# EAGLE design sensormoisture (EAGLE 7.2.0)
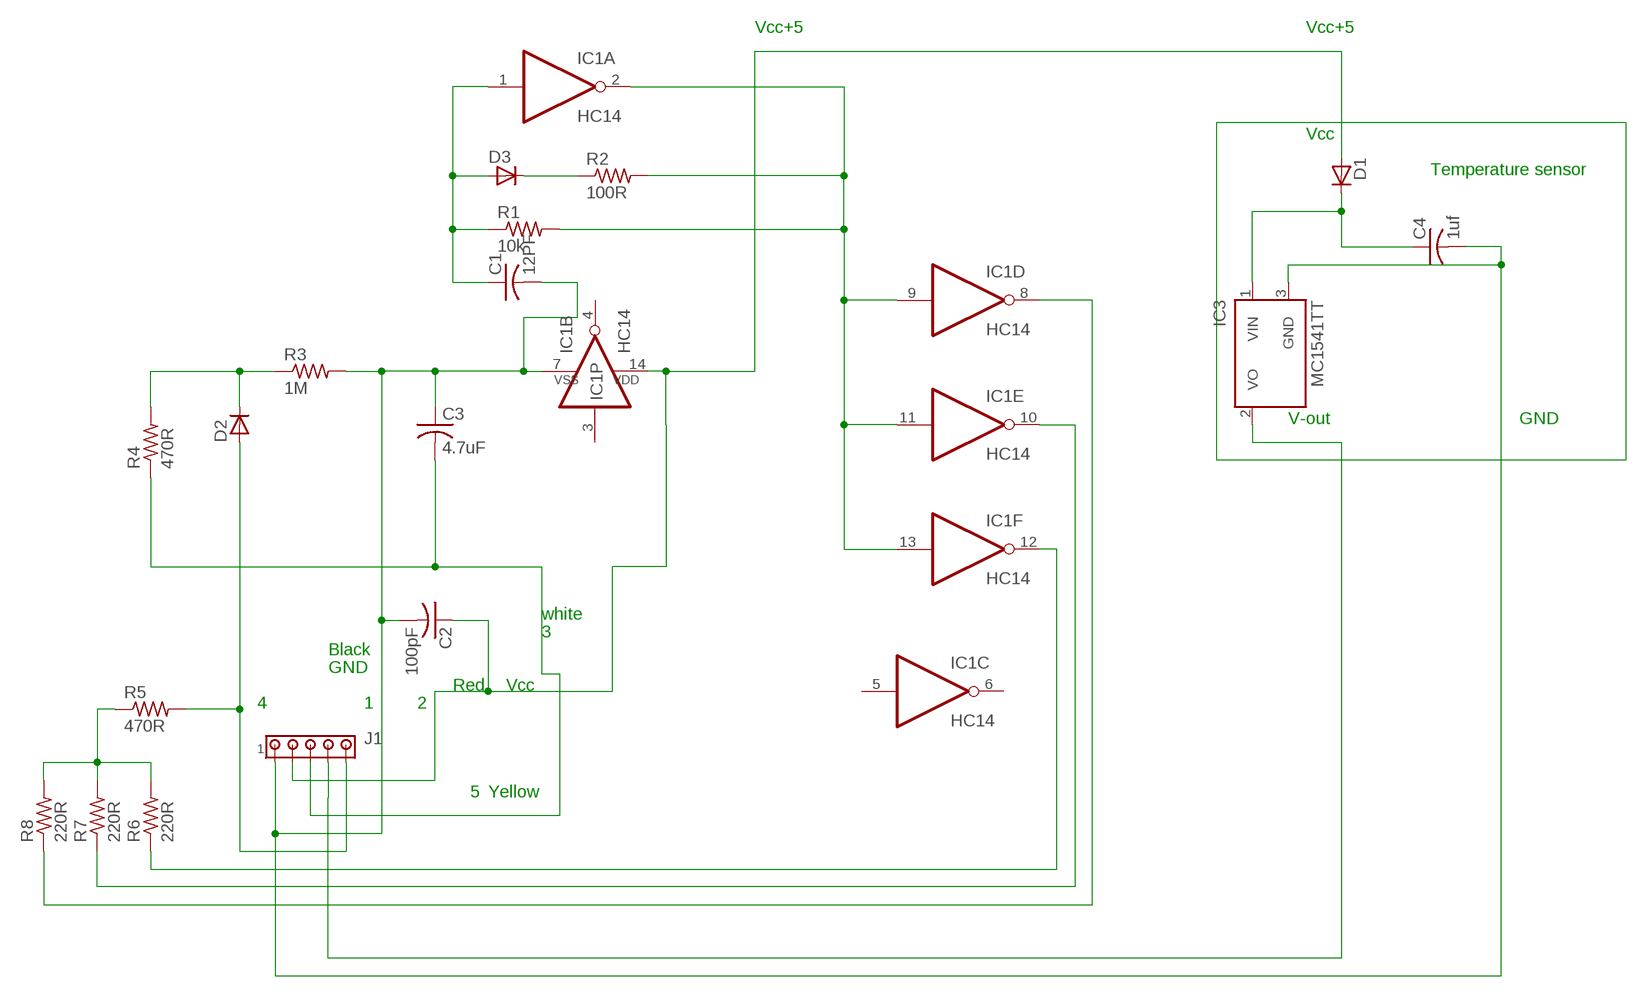
[diagram p0: schematic, sheet 1]

## Parts
C1  12PF  C-USC0805  [C0805]
C2  100pF  C-USC1206K  [C1206K]
C3  4.7uF  C-USC1206  [C1206]
C4  1uf  C-USC1206K  [C1206K]
D1  D-MLL-34  [MELF-MLL34]
D2  D-MLL-34  [MELF-MLL34]
D3  D-MLL-34  [MELF-MLL34]
IC1  HC14  4584D  [SO14]
IC3  MC1541TT  [SOT23]
J1  MTA05-100  [10X05MTA]
R1  10k  R-US_M0805  [M0805]
R2  100R  R-US_M0805  [M0805]
R3  1M  R-US_M0805  [M0805]
R4  470R  R-US_M0805  [M0805]
R5  470R  R-US_M0805  [M0805]
R6  220R  R-US_M0805  [M0805]
R7  220R  R-US_M0805  [M0805]
R8  220R  R-US_M0805  [M0805]

## Nets
N$1: C1.1 D3.2(A) IC1.1(A:I) R1.1
N$2: D3.1(C) R2.1
N$3: IC1.2(A:O) IC1.9(D:I) IC1.11(E:I) IC1.13(F:I) R1.2 R2.2
N$5: R5.1 R6.2 R7.2 R8.2
N$6: C2.1 D1.2(A) IC1.14(P:VDD) J1.2
N$7: C4.1 D1.1(C) IC3.1(VIN)
N$8: D2.1(C) R3.1 R4.2
N$9: D2.2(A) J1.5 R5.2
N$10: C3.2 J1.3 R4.1
N$12: IC1.12(F:O) R6.1
N$13: IC1.10(E:O) R7.1
N$14: IC1.8(D:O) R8.1
N$15: C1.2 C2.2 C3.1 C4.2 IC1.7(P:VSS) IC3.3(GND) J1.1 R3.2
N$19: IC3.2(VO) J1.4
Unconnected: IC1.3(B:I) IC1.4(B:O) IC1.5(C:I) IC1.6(C:O)

## Notes on the sheet
- Vcc+5 | Vcc+5
- Vcc
- Temperature sensor
- V-out | GND
- white
- 3
- Black
- GND
- Red | Vcc
- 4 | 1 | 2
- 5 | Yellow

## Library data of the parts
C1-C4 = resistor:C-US: CAPACITOR, American symbol
D1-D3 = semicon-smd-ipc:D-: DIODE unfilled
IC1 = 45xx:4584: Hex SCHMITT TRIGGER (74C14)
IC3 = microchip:MC15*: 2.5V and 4.096V Voltage References Source: http://www.microchip.com .. 21653b.pdf; OC_FARNELL: unknown; OC_NEWARK: unknown
J1 = con-amp:MTA05-100: AMP connector
R1-R8 = resistor:R-US_: RESISTOR, American symbol

## Board
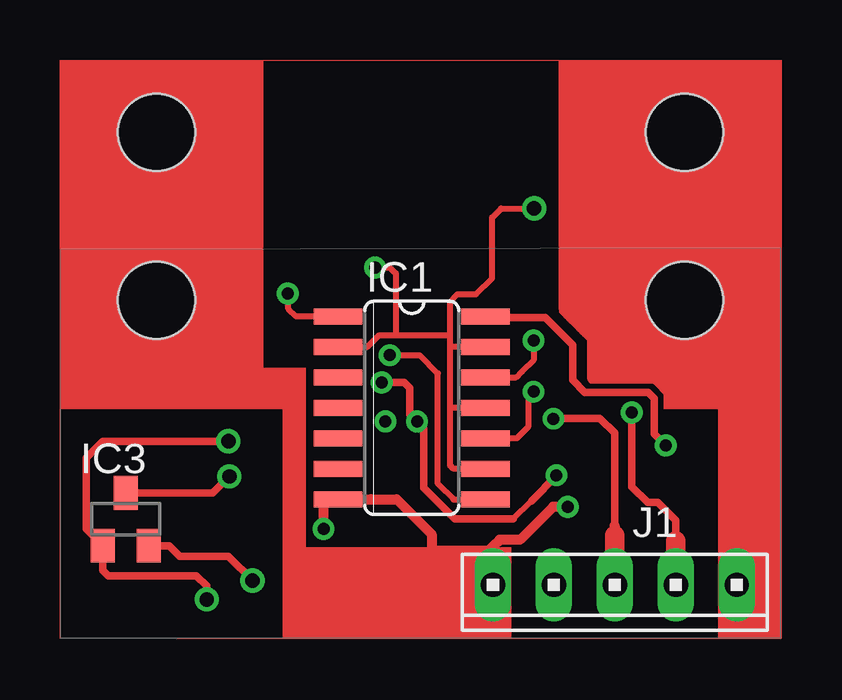
[diagram p1: board, top side]
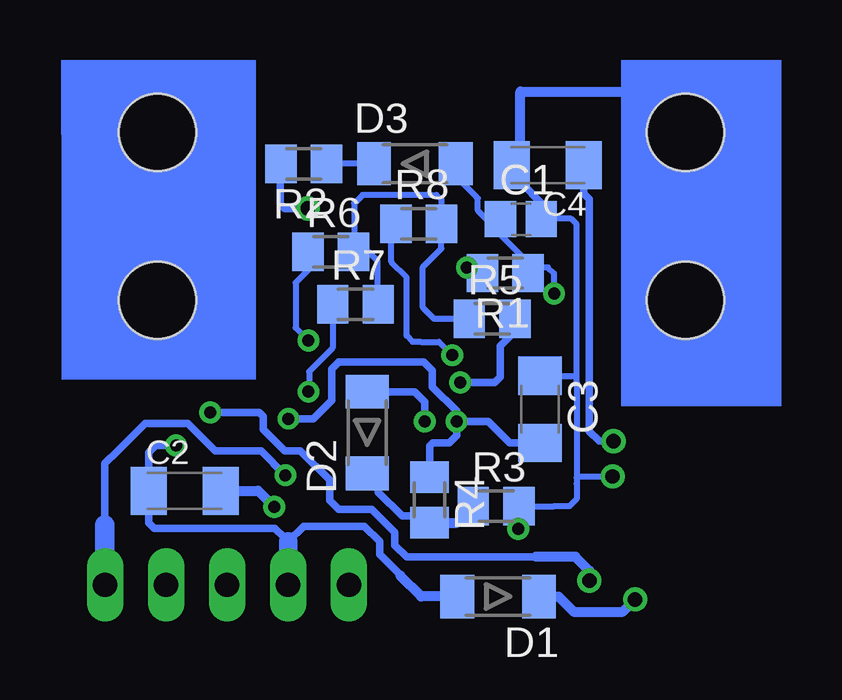
[diagram p2: board, bottom side, seen from below]

No outline drawn. Coordinates in mm, seen from the top.
Copper layers (1*16): Top 0.035mm / dielectric 1.5mm / Bottom 0.035mm
Design rules "default": minimum track width 10mil, minimum drill 24mil, track to track 8mil, track to pad 8mil, pad to pad 8mil, via to via 8mil, smd to smd 8mil, copper to edge 40mil, drill to drill 8mil, minimum pad ring 10mil, minimum via ring 8mil, stop-mask expansion 4mil, vias tented up to drill 0mil, thermal gap 10mil
Holes 3.2 mm at 26,21.1 4,21.1 4,14.1 26,14.1
vRestrict: area 1.1,11.2 to 6.9,17; area 1.1,18.2 to 6.9,24; area 23.1,18.2 to 28.9,24; area 23.1,11.2 to 28.9,17; 15 lines

### Footprints (pad centres in the part's own frame; a part is rotated, then mirrored left to right if it is on the bottom)
C0805 = smd 1.3 x 1.5: 1 -0.85,0; 2 0.85,0
C1206K = smd 1.5 x 2: 1 -1.5,0; 2 1.5,0
C1206 = smd 1.6 x 1.8: 1 -1.4,0; 2 1.4,0
MELF-MLL34 = smd 1.4 x 1.8: 1 -1.7,0; 2 1.7,0
SO14 = smd 0.66 x 2.032: 1 -3.81,-3.073; 2 -2.54,-3.073; 3 -1.27,-3.073; 4 0,-3.073; 5 1.27,-3.073; 6 2.54,-3.073; 7 3.81,-3.073; 8 3.81,3.073; 9 2.54,3.073; 10 1.27,3.073; 11 0,3.073; 12 -1.27,3.073; 13 -2.54,3.073; 14 -3.81,3.073
SOT23 = smd 1 x 1.4: 1 -0.95,-1.1; 2 0.95,-1.1; 3 0,1.1
10X05MTA = drill 1.016 long: 1 5.08,0; 2 2.54,0; 3 0,0; 4 -2.54,0; 5 -5.08,0
M0805 = smd 1.3 x 1.6: 1 -0.95,0; 2 0.95,0

### Placement (x,y rotation side)
C1  10.86,17.48 0 bottom
C2  24.87,6.16 0 bottom
C3  10.06,9.55 270 bottom
C4  9.74,19.73 180 bottom
D1  11.81,1.75 180 bottom
D2  17.26,8.58 90 bottom
D3  15.27,19.79 0 bottom
IC1  14.64,9.61 270 top
IC3  2.72,4.97 0 top
J1  23.1,2.23 180 top
R1  11.51,15.23 180 bottom
R2  19.9,19.79 180 bottom
R3  11.89,5.51 0 bottom
R4  14.66,5.78 270 bottom
R5  12.06,13.32 0 bottom
R6  18.78,16.12 0 bottom
R7  17.75,13.93 0 bottom
R8  15.11,17.29 0 bottom

### Tracks (layer width: path | path; a pad name or v marks a point on that pad's centre or on a via)
N$1  (via drill 0.5)
  Top 0.254: IC1.1 9.82,13.42 9.5,13.74 9.5,14.35 v9.47,14.38
  Bottom 0.254: v9.47,14.38 9.47,15.21 9.73,15.47 10.27,15.47 | 10.27,15.47 R1.1 | 10.27,15.47 10.34,15.47 11.71,16.84 C1.1 12.3,17.48 12.65,17.83 12.65,18.34 12.72,18.41 13.31,19 13.31,19.53 D3.2
N$2
  Bottom 0.254: D3.1 R2.1
N$3  (via drill 0.5, 0.6)
  Top 0.254: IC1.2 12.79,12.15 13.28,12.65 13.97,12.65 | 17.7,12.14 IC1.13 16.27,12.15 16.23,12.12 | IC1.9 16.42,7.07 16.37,7.07 16.23,7.21 16.23,9.6 | 16.23,9.6 16.23,12.12 | 16.23,12.12 16.23,12.68 | IC1.11 16.24,9.61 16.23,9.6 | 13.97,12.65 16.2,12.65 16.23,12.68 | 16.23,12.68 16.23,14.05 16.54,14.35 17.32,14.35 17.98,15.01 17.98,17.55 18.36,17.93 v19.74,17.93 | v13.11,15.47 13.72,15.47 13.97,15.21 13.97,12.65
  Bottom 0.254: R1.2 v13.1,15.46 v13.11,15.47
  Bottom 0.305: v19.74,17.93 20.7,17.93 20.88,18.11 20.88,19.77 R2.2
N$4
  Bottom 0.406: 11.08,19.6 10.88,19.6 10.88,22.8 6.24,22.8 6.24,22.84
N$5
  Bottom 0.254: 17.67,16.28 R6.2 | R6.2 17.22,16.12 16.84,15.75 16.84,13.98 R7.2 | R6.2 17.8,16.15 17.8,18.14 17.45,18.49 14.58,18.49 14.38,18.49 14.17,18.29 14.17,17.3 R8.2 14.17,17.28 14.17,16.26 14.94,15.49 14.94,13.79 14.47,13.32 R5.1
N$6  (via drill 0.5)
  Top 0.254: 17.67,13.39 IC1.14 17.7,13.41
  Top 0.305: 17.67,13.39 20.19,13.39 21.34,12.24 21.34,10.77 21.84,10.26 24.49,10.26 24.74,10.01 24.74,8.53 v25.22,8.05
  Bottom 0.305: 15.88,2.62 15.88,2.64 16.66,3.43 16.74,3.5 16.74,3.96 16.74,4.04 17.37,4.67 19.91,4.67 20.55,4.04 20.73,4.22 21.11,4.6 24.92,4.6 26.14,4.6 26.36,4.83 C2.1 | C2.1 | v25.22,8.05 26.06,8.05 26.36,7.75 C2.1
  Bottom 0.406: D1.2 15.01,1.75 15.88,2.62 | C2.1
  Bottom 0.762: J1.2 20.56,4.03 20.55,4.04
N$7  (via drill 0.6)
  Top 0.305: 6.98,8.2 1.75,8.2 1.07,7.52 1.07,4.57 IC3.1 1.75,3.85 1.75,2.85 1.98,2.62 5.66,2.62 6.1,2.18 v6.1,1.63
  Top 0.406: 6.98,8.2 v7,8.22
  Bottom 0.305: C4.1 8.23,19.72 8.23,18.54 8,18.31 8,11.76 8,8.64 7.59,8.23 v7,8.23 v7,8.22
  Bottom 0.406: D1.1 9.29,1.75 8.66,1.12 6.6,1.12 v6.1,1.63
N$8
  Bottom 0.305: 14.94,5.11 15.8,5.11 16.79,6.1 16.79,6.41 D2.1
  Bottom 0.406: R3.1 13.52,4.83 R4.2 14.94,5.11
N$9  (via drill 0.5)
  Top 0.254: 18.87,4.98 19.63,5.74
  Top 0.305: v20.66,6.81 20.66,6.77 19.63,5.74 | v13.39,10.67 14.33,10.67 14.55,10.44 14.55,9.35 v14.86,9.04 15.14,8.76 15.14,6.27 16.43,4.98 18.87,4.98
  Bottom 0.254: 17.27,10.27 D2.2
  Bottom 0.305: 28.19,4.72 28.19,6.55 28.19,7.29 27.66,7.82 26.52,8.97 25.96,8.97 24.74,8.97 23.6,7.82 21.68,7.82 v20.66,6.81 | D2.2 15.28,10.28 14.86,9.86 v14.86,9.04 | R5.2 11.11,12.8 11.71,12.19 11.71,10.9 11.94,10.67 v13.39,10.67
  Bottom 0.406: 28.17,2.24 J1.5
  Bottom 0.813: 28.19,4.72 28.19,2.25 J1.5
N$10  (via drill 0.5)
  Top 0.305: 23.09,4.7 23.09,6.53 23.09,8.56 22.48,9.17 v20.55,9.17 v20.54,9.16
  Top 0.406: 23.11,2.25 J1.3 | 23.09,4.7 23.09,4.29
  Top 0.813: 23.09,4.29 23.09,2.24 J1.3
  Bottom 0.305: v20.54,9.16 19.52,9.16 18.75,9.93 18.75,11.23 18.44,11.53 14.91,11.53 14.55,11.18 14.55,10.49 13.54,9.47 v13.54,9.04 | C3.2 11.33,8.15 12.22,9.04 v13.54,9.04 | v13.54,9.04 13.54,8.46 13.84,8.15 14.53,8.15 14.66,8.03 R4.1
N$11
  Top 0.04: 20.78,13.74 20.78,13.6 21.96,12.42
N$12  (via drill 0.5)
  Top 0.254: IC1.12 18.99,10.88 19.23,11.12 19.71,11.61 v19.71,12.42
  Bottom 0.254: R6.1 19.73,15.35 20.24,14.83 20.24,12.95 v19.71,12.42
N$13  (via drill 0.5)
  Top 0.254: IC1.10 17.72,8.36 19.02,8.36 19.51,8.84 19.51,10.08 v19.71,10.29
  Bottom 0.254: v19.71,10.29 19.68,10.31 19.68,11.12 18.7,12.11 R7.1
N$14  (via drill 0.5)
  Top 0.254: IC1.8 17.7,5.79 16.38,5.79 15.72,6.45 15.72,11.05 14.96,11.81 v13.72,11.81
  Bottom 0.254: v13.72,11.81 14.28,12.37 15.04,12.37 15.37,12.37 15.62,12.62 15.62,15.06 16.26,15.7 16.26,17.3 R8.1
N$15  (via drill 0.5, 0.6)
  Top 0.305: IC3.3 6.35,6.07 v7.04,6.76
  Top 0.406: IC1.7 11.55,5.82 IC1.7 | IC1.7 12.93,5.8 14.01,5.8 15.47,4.34 15.47,3.67 | v10.96,4.57 10.96,5.78 10.95,5.79 IC1.7 | v21.13,5.49 20.52,5.49 19.15,4.12 18.3,4.12 18.04,3.86 | 15.47,3.67 15.46,3.66 | 18.04,3.86 18.04,2.25 J1.1 | 15.47,3.67 17.85,3.67 18.04,3.86
  Bottom 0.254: R3.2 9.47,5.51 8.84,5.51 8.53,5.82 8.53,6.45 8.53,6.71 | 8.53,6.71 8.53,10.69 8.53,10.97 | 7.06,6.73 8.51,6.73 8.53,6.71 | 8.53,10.97 8.53,17.27 8.76,17.5 9.48,17.5 C1.2 | C3.1 8.55,10.95 8.53,10.97
  Bottom 0.305: 7.06,6.73 v7.04,6.76 | 11.25,19.71 C4.2 10.85,19.33 10.85,19 10.01,18.16 C1.2
  Bottom 0.406: 10.94,5.02 R3.2 10.94,4.59 v10.96,4.57 | v21.14,5.49 v21.13,5.49 21.8,6.16 C2.2
  Bottom 0.635: R3.2
N$16
  Top 0.04: 21.96,10.84 21.96,10.78 22.08,10.66 22.28,10.66
N$18
  Top 0.04: 24.76,10.68 24.76,10.58 | 24.76,10.58 25.18,10.16 | 24.76,10.58 24.68,10.66
N$19  (via drill 0.5, 0.6)
  Top 0.305: 25.63,4.06 25.63,4.93 24.89,5.66 24.46,5.66 23.8,6.33 v23.8,9.42 | v8,2.41 6.99,3.43 4.98,3.43 4.54,3.87 IC3.2
  Top 0.813: J1.4 25.64,4.05 25.63,4.06
  Bottom 0.305: v23.8,9.42 21.77,9.42 21.59,9.25 21.59,8.71 21.36,8.48 20.7,7.82 20.04,7.82 18.82,6.6 18.82,6.27 18.82,5.77 18.44,5.38 17.25,5.38 17.07,5.38 16.1,4.42 16.1,3.89 15.62,3.4 10.82,3.4 10.24,3.4
  Bottom 0.406: v8,2.41 8,2.82 8.59,3.4 10.24,3.4
N$21
  Top 0.02: 4.84,0 30.04,0 | 30.04,0 30.04,21 30.04,0 | 0,21 0,9.56 | 0,9.56 4.84,9.56 0,9.56 | 0,9.56 0,21 | 30.04,0 4.84,0 | 4.84,0 0,0 | 0,0 0,21 | 0,0 0,24.1 30.04,24.1 30.04,0 | 30.04,0 0,0
(copper drawn outside any net)
  shapes: Bottom area x4, Top area x63

### Text on the board
tTest: 23.1 | 21.1 | 14.1 | 10.6 | GND | VCC | Write | Yellow
bTest: 1uF | 1N4148 | 100R | 12pF | 220R | 220R | 10K | 220R | 470R | 1N4148 | 4.7uF | 1M | 100uF | 470R | 1N4148
vRestrict: Screw Head | Screw Hold